# Altium schematic sheet abs_enc_driver.SchDoc
size A4; SheetNumber: 3; SheetTotal: 8
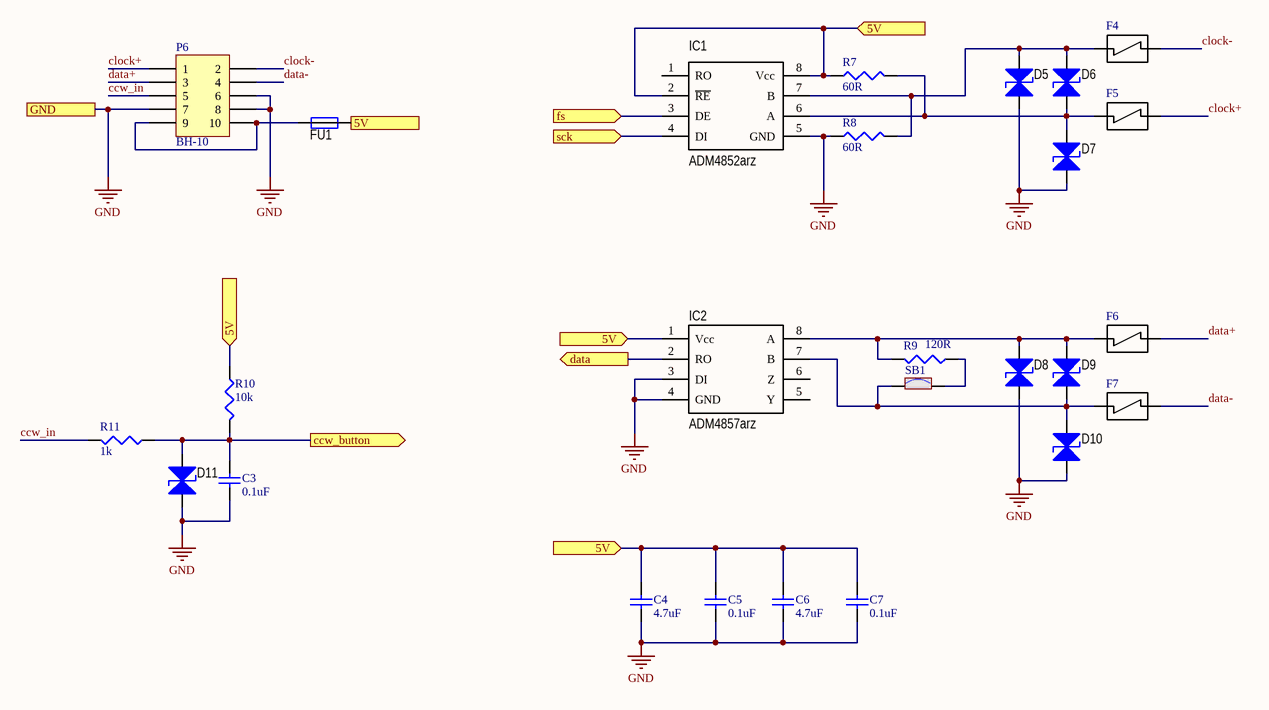
[diagram p0: abs_enc_driver.SchDoc]

## Parts
C3  0.1uF  [C1608-0603]
C4  4.7uF  [C1608-0603]
C5  0.1uF  [C1608-0603]
C6  4.7uF  [C1608-0603]
C7  0.1uF  [C1608-0603]
D5  SMBJ5.0CA  [SMB_H]  (value not drawn)
D6  SMBJ5.0CA  [SMB_H]  (value not drawn)
D7  SMBJ5.0CA  [SMB_H]  (value not drawn)
D8  SMBJ5.0CA  [SMB_H]  (value not drawn)
D9  SMBJ5.0CA  [SMB_H]  (value not drawn)
D10  SMBJ5.0CA  [SMB_H]  (value not drawn)
D11  SMBJ5.0CA  [SMB_H]  (value not drawn)
F4  TBU-CA065-200-WH  [TBU_CA]  (value not drawn)
F5  TBU-CA065-200-WH  [TBU_CA]  (value not drawn)
F6  TBU-CA065-200-WH  [TBU_CA]  (value not drawn)
F7  TBU-CA065-200-WH  [TBU_CA]  (value not drawn)
FU1  MF-MSMF030  [MF-MSMF]  (value not drawn)
IC1  ADM4852arz  [SO8_N]
IC2  ADM4857arz  [SO8_N]
P6  BH-10  [BH-10]
R7  60R  [R1608-0603]
R8  60R  [R1608-0603]
R9  120R  [R1608-0603]
R10  10k  [R1608-0603]
R11  1k  [R1608-0603]
SB1  (no value)  [SOLDER-BRIDGE_R0603-0R]  (no BOM)

## Ports
5V (in), ccw_button (out), data (out), fs (in), GND, sck (in)

## Nets
GND: C3.1 C4.1 C5.1 C6.1 C7.1 D5.1(K) D7.1(K) D8.1(K) D10.1(K) D11.1(K) IC1.5(GND) IC2.3(DI) IC2.4(GND) P6.6 P6.7 P6.8 R8.1 ; port GND
5V: C4.2 C5.2 C6.2 C7.2 FU1.2 IC1.2(~{RE}) IC1.8(Vcc) IC2.1(Vcc) R7.1 R10.1 ; port 5V
ccw_button: C3.2 D11.2(A) R10.2 R11.1 ; port ccw_button
ccw_in: P6.5 R11.2
clock+: F5.1 P6.1
clock-: F4.1 P6.2
data: IC2.2(RO) ; port data
data+: F6.1 P6.3
data-: F7.1 P6.4
fs: IC1.3(DE) ; port fs
sck: IC1.4(DI) ; port sck
NetD5_2: D5.2(A) D6.2(A) F4.0 IC1.7(B) R8.2
NetD6_1: D6.1(K) D7.2(A) F5.0 IC1.6(A) R7.2
NetD8_2: D8.2(A) D9.2(A) F6.0 IC2.8(A) R9.2
NetD9_1: D9.1(K) D10.2(A) F7.0 IC2.7(B) SB1.1
NetFU1_1: FU1.1 P6.9 P6.10
NetR9_1: R9.1 SB1.2

Not connected (* = marked no-connect by the designer): IC1 1(RO); IC2 5(Y) 6(Z)

## Library data of the parts
C3-C7 = Cap: Керамическийконденсатор; Корпус: 0603 (1608 Metric); Диэлектрик: X5R; Напряжение: 16B; Вид монтажа: SMD; Температурный диапазон: -55 ~ 100; Тип элемента: Керамический конденсатор
  C3 C5 C7: Номинал: 0.1uF
  C4 C6: Номинал: 4.7uF
D5-D11 = SMBJ_CА: Супрессор двунаправленный; Производитель: ST MICROELECTRONICS CO., LTD.; Корпус: DO-214AA, SMB; Номинал: 5В; Вид монтажа: SMD; Тип элемента: Защитный диод; Температурный диапазон: -55°C ~ 150°C; Название: SMBJ5.0CA; Артикул: SMBJ5.0CA; ComponentLink: http://www.digikey.com/product-detail/en/SMBJ5.0CA/SMBJ5.0CABTR-ND/2254207
F4-F7 = TBU-CA: Самовосстанавливающийся предохранитель; Производитель: Bourns; Корпус: DFN; Номинал: 0.4A; Вид монтажа: SMD; Температурный диапазон: -40 to +125 °C; Название: TBU-CA065-200-WH; Артикул: TBU-CA065-200-WH; Тип элемента: Самовосстанавливающийся предохранитель
FU1 = MF-MSMF030: PTC Resettable Fuses; Производитель: Bourns; Корпус: 1812; Номинал: 0.3А; Вид монтажа: SMD; Тип элемента: Самовосстанавливающийся предохранитель; Температурный диапазон: -40…85; Напряжение: 13.2В; Название: MF-MSMF030; Артикул: MF-MSMF030
IC1 = ADM4852: RS-485 Трансивер; Производитель: Analog Devices; Корпус: SOIC8; Вид монтажа: SMD; Тип элемента: Драйвер интерфейса RS-485; Температурный диапазон: -40°C ~ 85°C; Артикул: ADM4852arz; Название: ADM4852arz
IC2 = ADM4857: RS-485 Трансивер; Производитель: Analog Devices; Корпус: SOIC8; Вид монтажа: SMD; Тип элемента: Драйвер интерфейса RS-485; Температурный диапазон: -40°C ~ 85°C; Артикул: ADM4857arz; Название: ADM4857arz
P6 = BH-10: Разъем штыревой на плату; Производитель: Connfly electronic (Zhenqin); Номинал: 1А; Напряжение: 300В; Вид монтажа: DIP; Температурный диапазон: -55…140; Примечание: шаг 2.54 мм; Название: BH-10; Артикул: BH-10; Тип элемента: Разъем
R7-R11 = resistor: SMD резистор; Производитель: 1%; Корпус: 0603 (1608 Metric); Точность: 1%; Название: Резистор; Вид монтажа: SMD; Тип элемента: Резистор
  R7 R8: Номинал: 60R
  R9: Номинал: 120R
  R10: Номинал: 10k
  R11: Номинал: 1k
SB1 = SB: Перемычка